# Altium project LIS302DL.PrjPcb
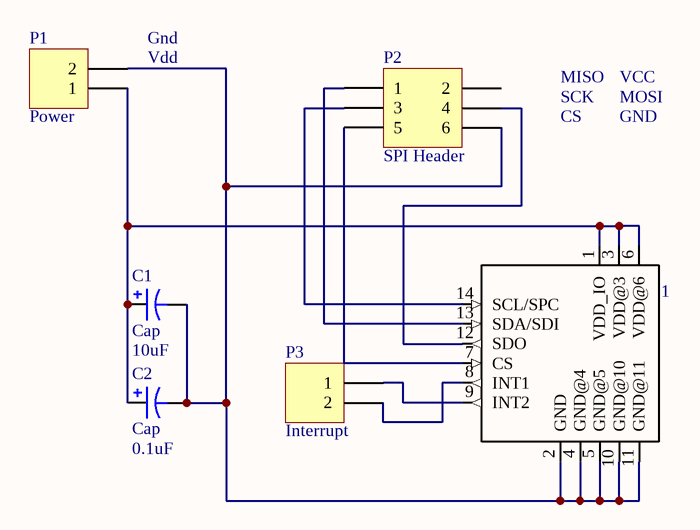
[diagram p0: Sheet1.SchDoc]
1 sheet, 6 parts. Net scope: global (net labels, ports and power ports of the same name join across sheets).
Board file: PCB1.PcbDoc

## Sheet Sheet1.SchDoc
size A

### Parts
1  LIS302DL  [LGA14_LIS302DL(Primary)]  (value not drawn)
C1  Cap  value 10uF  [C0805]
C2  Cap  value 0.1uF  [C0805]
P1  Power  [HDR1X2]
P2  SPI Header  [HDR2X3]
P3  Interrupt  [HDR1X2]

### Nets
Net1_1: 1.1(VDD_IO) 1.3(VDD@3) 1.6(VDD@6) C1.1 C2.1 P1.1
Net1_2: 1.2(GND) 1.4(GND@4) 1.5(GND@5) 1.10(GND@10) 1.11(GND@11) C1.2 C2.2 P1.2 P2.6
Net1_7: 1.7(CS) P2.5
Net1_8: 1.8(INT1) P3.2
Net1_9: 1.9(INT2) P3.1
Net1_12: 1.12(SDO) P2.4
Net1_13: 1.13(SDA/SDI) P2.1
Net1_14: 1.14(SCL/SPC) P2.3

Not connected (* = marked no-connect by the designer): P2 2

### Notes on the sheet
- (near P1) Gnd
- (near P1) Vdd
- MISO
- SCK
- CS
- VCC
- MOSI
- GND

### Library data of the parts
C1 C2 = Cap Pol3: Polarized Capacitor (Surface Mount); Published: 8-Jun-2000; LatestRevisionDate: 29-May-2009; LatestRevisionNote: IPC-7351 Footprint Added.; PackageReference: C0805; Publisher: Altium Limited; PackageDescription: Chip Capacitor
P1 P3 = Header 2: Header, 2-Pin; LatestRevisionDate: 17-Jul-2002; LatestRevisionNote: Re-released for DXP Platform.; Publisher: Altium Limited
P2 = Header 3X2: Header, 3-Pin, Dual row; LatestRevisionDate: 17-Jul-2002; LatestRevisionNote: Re-released for DXP Platform.; Publisher: Altium Limited
1 = LIS302DL: Value: *